# Altium schematic sheet db25.SchDoc: Hall / Hub Board / DB25
size A4; DocumentNumber: 3; SheetNumber: 3; SheetTotal: 7
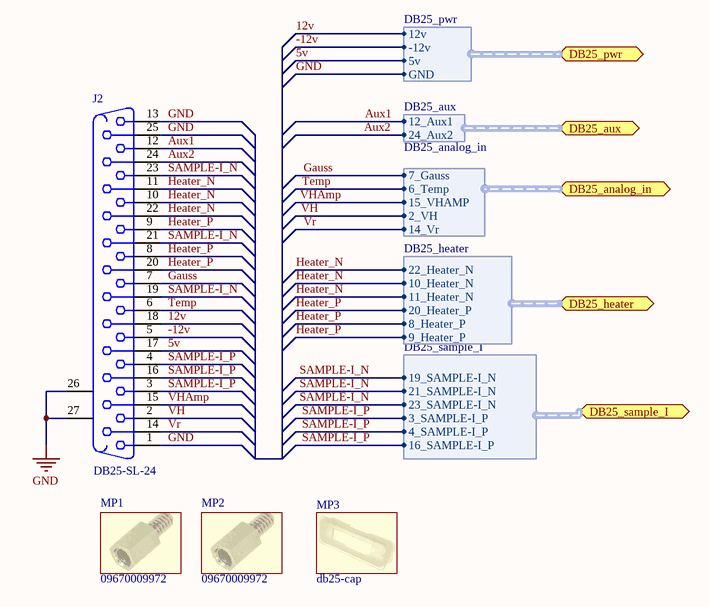
[diagram p0: db25.SchDoc]

## Parts
J2  Manufacturer Part Number: DB25-SL-24  [DB25]
MP1  09670009972  (mechanical)
MP2  09670009972  (mechanical)
MP3  db25-cap  (mechanical)

## Ports
DB25_analog_in (harness DB25_analog_in), DB25_aux (harness DB25_aux), DB25_heater (harness DB25_heater), DB25_pwr (harness DB25_pwr), DB25_sample_I (harness DB25_sample_I)

## Harnesses
DB25_aux: 12_Aux1, 24_Aux2
DB25_sample_I: 16_SAMPLE-I_P, 19_SAMPLE-I_N, 21_SAMPLE-I_N, 23_SAMPLE-I_N, 3_SAMPLE-I_P, 4_SAMPLE-I_P
DB25_heater: 10_Heater_N, 11_Heater_N, 20_Heater_P, 22_Heater_N, 8_Heater_P, 9_Heater_P
DB25_analog_in: 14_Vr, 15_VHAMP, 2_VH, 6_Temp, 7_Gauss
DB25_pwr: 12v, -12v, 5v, GND

## Nets
GND: J2.1 J2.13 J2.25 J2.26(MH1) J2.27(MH2) ; port DB25_pwr.GND
5v: J2.17 ; port DB25_pwr.5v
12v: J2.18 ; port DB25_pwr.12v
-12v: J2.5 ; port DB25_pwr.-12v
Aux1: J2.12 ; port DB25_aux.12_Aux1
Aux2: J2.24 ; port DB25_aux.24_Aux2
Gauss: J2.7 ; port DB25_analog_in.7_Gauss
Heater_N: J2.10 J2.11 J2.22 ; port DB25_heater.10_Heater_N, port DB25_heater.11_Heater_N, port DB25_heater.22_Heater_N
Heater_P: J2.8 J2.9 J2.20 ; port DB25_heater.20_Heater_P, port DB25_heater.8_Heater_P, port DB25_heater.9_Heater_P
SAMPLE-I_N: J2.19 J2.21 J2.23 ; port DB25_sample_I.19_SAMPLE-I_N, port DB25_sample_I.21_SAMPLE-I_N, port DB25_sample_I.23_SAMPLE-I_N
SAMPLE-I_P: J2.3 J2.4 J2.16 ; port DB25_sample_I.16_SAMPLE-I_P, port DB25_sample_I.3_SAMPLE-I_P, port DB25_sample_I.4_SAMPLE-I_P
Temp: J2.6 ; port DB25_analog_in.6_Temp
VH: J2.2 ; port DB25_analog_in.2_VH
VHAmp: J2.15 ; port DB25_analog_in.15_VHAMP
Vr: J2.14 ; port DB25_analog_in.14_Vr

## Notes on the sheet
- Title
- Size:
- Date:
- A4
- Number:
- Time:
- Revision:
- Sheet
- of
- Fermium LABS srl
- Via Monselice 15a
- 35142 Padova PD
- Italy
- File:

## Library data of the parts
J2 = D Connector 25: d-sub, 25 pins,  Right Angle; Manufacturer: ADAM TECH; Pads: 29 THT; Supplier 1: TME; Supplier Part Number 1: DB25-SL-24; Category: D-Sub connectors
MP1 MP2 = 09670009972: Manufacturer: HARTING; Supplier 1: TME; Supplier Part Number 1: 09670009972; Manufacturer Part Number: 09670009972
MP3 = db25-cap: Manufacturer Part Number: 2105-0100-03; Manufacturer: Encitech; Supplier 1: TME; Supplier Part Number 1: DC25-P